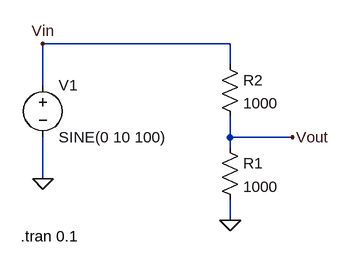
[diagram p0: schematic lab01-Voltage-divider.asc]
lab01-Voltage-divider.asc, the LTspice schematic file:
Version 4
SHEET 1 880 680
WIRE 304 32 16 32
WIRE 304 64 304 32
WIRE 16 96 16 32
WIRE 304 176 304 144
WIRE 400 176 304 176
WIRE 304 192 304 176
WIRE 16 240 16 176
WIRE 304 304 304 272
FLAG 16 240 0
FLAG 304 304 0
FLAG 16 32 Vin
FLAG 400 176 Vout
SYMBOL res 288 176 R0
SYMATTR InstName R1
SYMATTR Value 1000
SYMATTR SpiceLine pwr=0.5
SYMBOL res 288 48 R0
SYMATTR InstName R2
SYMATTR Value 1000
SYMATTR SpiceLine pwr=0.5
SYMBOL voltage 16 80 R0
WINDOW 123 0 0 Left 0
WINDOW 39 0 0 Left 0
SYMATTR InstName V1
SYMATTR Value SINE(0 10 100)
TEXT -18 328 Left 0 !.tran 0.1

The netlist it stands for:
* lab01-Voltage-divider.asc
R1 Vout 0 1000 pwr=0.5
R2 Vin Vout 1000 pwr=0.5
V1 Vin 0 SINE(0 10 100)
.tran 0.1
.backanno
.end